# EAGLE design tesselcon4 (EAGLE 7.6.0)
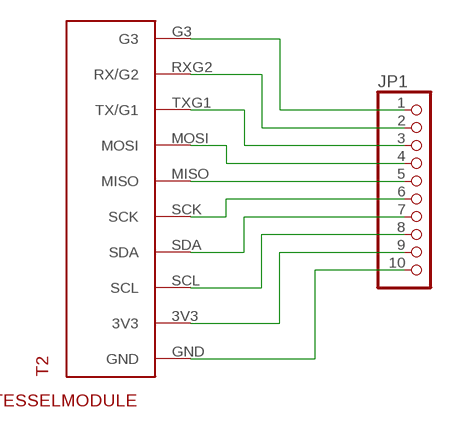
[diagram p0: schematic, sheet 1]

## Parts
JP1  PINHD-1X10/90  [1X10/90]
T2  TESSELMODULE  [TESSELMODULE]

## Nets
N$1: JP1.10 T2.GND
N$2: JP1.9 T2.3V3
N$3: JP1.8 T2.SCL
N$4: JP1.7 T2.SDA
N$5: JP1.6 T2.SCK
N$6: JP1.5 T2.MISO
N$7: JP1.4 T2.MOSI
N$8: JP1.3 T2.TXG1(TX/G1)
N$9: JP1.2 T2.RXG2(RX/G2)
N$10: JP1.1 T2.G3

## Library data of the parts
JP1 = #pinhead:PINHD-1X10: PIN HEADER
T2 = tessel:TESSELMODULE

## Board
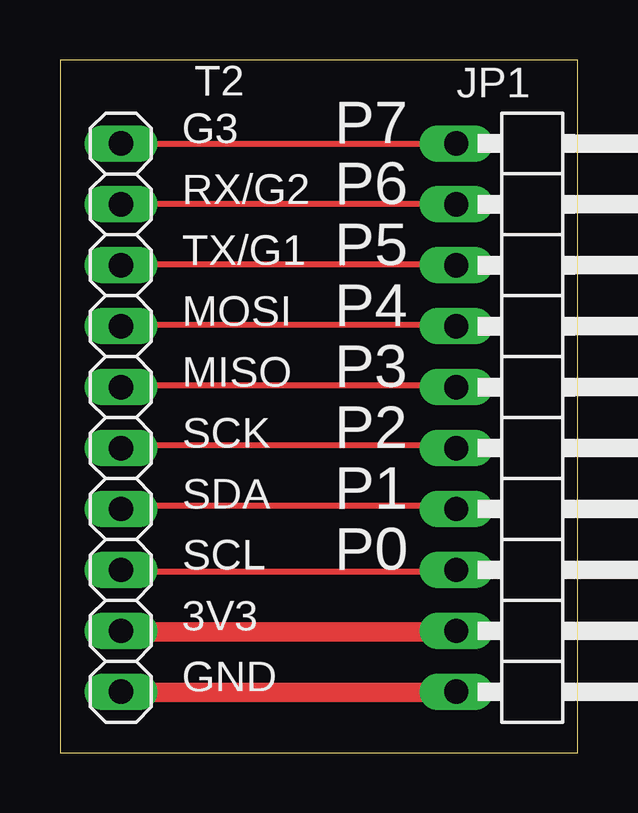
[diagram p1: board, top side]

Size 21.57 x 28.88 mm. Coordinates in mm from the lower left corner, seen from the top.
Outline: 0,0 21.57,0 21.57,28.88 0,28.88 0,0
Copper layers (1*16): Top 0.035mm / dielectric 1.5mm / Bottom 0.035mm
Design rules "default": minimum track width 10mil, minimum drill 24mil, track to track 8mil, track to pad 8mil, pad to pad 8mil, via to via 8mil, smd to smd 8mil, copper to edge 40mil, drill to drill 8mil, minimum pad ring 10mil, minimum via ring 8mil, stop-mask expansion 4mil, vias tented up to drill 0mil, thermal gap 10mil

### Footprints (pad centres in the part's own frame; a part is rotated, then mirrored left to right if it is on the bottom)
1X10/90 = drill 1.016 long: 1 -11.43,-3.81; 2 -8.89,-3.81; 3 -6.35,-3.81; 4 -3.81,-3.81; 5 -1.27,-3.81; 6 1.27,-3.81; 7 3.81,-3.81; 8 6.35,-3.81; 9 8.89,-3.81; 10 11.43,-3.81
TESSELMODULE = drill 1.016 long: 3V3 0,2.54; G3 0,22.86; GND 0,0; MISO 0,12.7; MOSI 0,15.24; RXG2 0,20.32; SCK 0,10.16; SCL 0,5.08; SDA 0,7.62; TXG1 0,17.78

### Placement (x,y rotation side)
JP1  20.32,13.97 270 top
T2  2.54,2.54 0 top

### Tracks (layer width: path | path; a pad name or v marks a point on that pad's centre or on a via)
N$1
  Top 0.254: 2.74,2.52 T2.GND | 16.46,2.52 JP1.10
  Top 0.813: 16.46,2.52 2.74,2.52
N$2
  Top 0.254: 2.74,5.03 T2.3V3 | 16.46,5.03 JP1.9
  Top 0.813: 16.46,5.03 2.74,5.03
N$3
  Top 0.254: T2.SCL 2.74,7.54 16.46,7.54 JP1.8
N$4
  Top 0.254: T2.SDA 2.74,10.29 16.46,10.29 JP1.7
N$5
  Top 0.254: T2.SCK 2.74,12.8 16.46,12.8 JP1.6
N$6
  Top 0.254: T2.MISO 2.74,15.32 16.46,15.32 JP1.5
N$7
  Top 0.254: T2.MOSI 2.74,17.83 16.46,17.83 JP1.4
N$8
  Top 0.254: T2.TXG1 2.74,20.34 16.46,20.34 JP1.3
N$9
  Top 0.254: JP1.2 T2.RXG2
N$10
  Top 0.254: T2.G3 2.74,25.38 16.46,25.38 JP1.1

### Text on the board
tNames: P7 | P6 | P5 | P4 | P3 | P2 | P1 | P0